# EAGLE schematic modifiedradio (EAGLE 7.5.0)
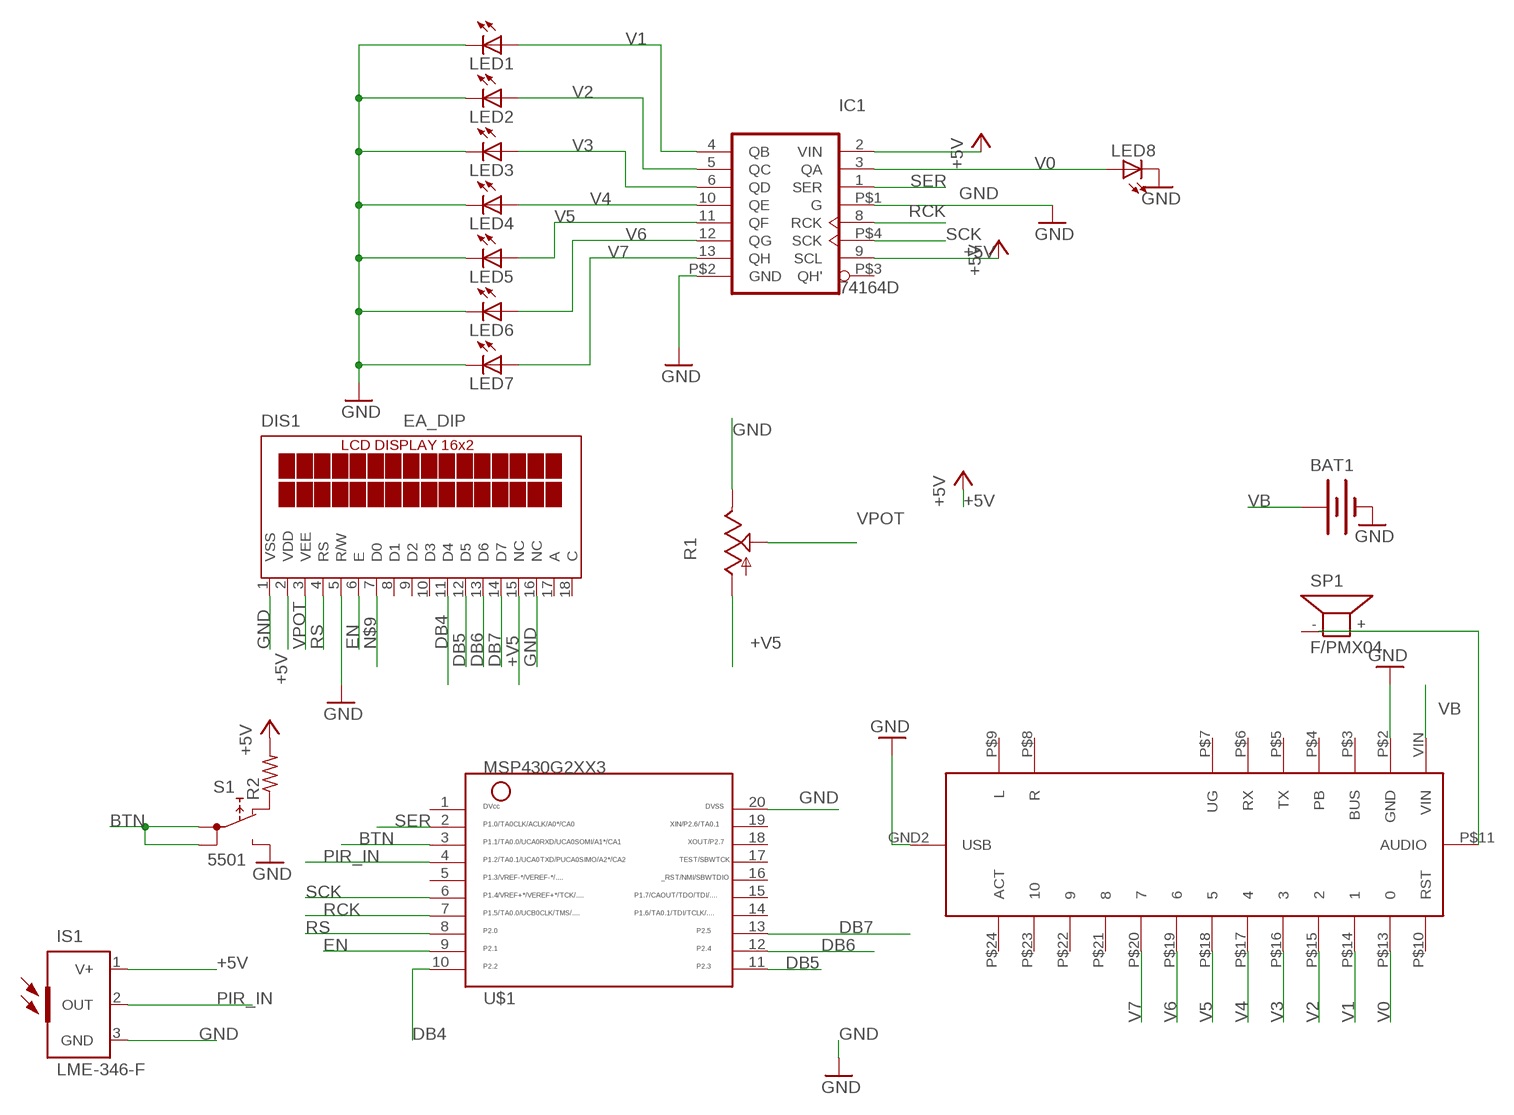
[diagram p0: schematic, sheet 1]

## Parts
BAT1  BATTERY  [BATTERY_PACK_2AA]
DIS1  EA_DIP  [EA_DIP]
IC1  74164D  [SO14]
IS1  LME-346-F  [TO39]
LED1  LED10MM  [LED10MM]
LED2  LED10MM  [LED10MM]
LED3  LED10MM  [LED10MM]
LED4  LED10MM  [LED10MM]
LED5  LED10MM  [LED10MM]
LED6  LED10MM  [LED10MM]
LED7  LED10MM  [LED10MM]
LED8  LED10MM  [LED10MM]
R1  TRIM_US-RS3  [RS3]
R2  R-US_0204/2V  [0204V]
S1  5501  [5501]
SP1  F/PMX04  [F/PMX04A]
U$1  MSP430G2XX3TSSOP  [PW20]
U$2  SOUNDBOARD  [SOUNDBOARD]

## Nets
+5V: DIS1.2(VDD) IC1.2(VIN) IC1.9(SCL) IS1.1(V+) R2.2
+V5: DIS1.15(NC) R1.A
BTN: S1.1A S1.1B U$1.3
DB4: DIS1.11(D4) U$1.10
DB5: DIS1.12(D5) U$1.11
DB6: DIS1.13(D6) U$1.12
DB7: DIS1.14(D7) U$1.13
EN: DIS1.6(E) U$1.9
GND: BAT1.GND(-) DIS1.1(VSS) DIS1.5(R/W) DIS1.16(NC) IC1.P$1(G) IC1.P$2(GND) IS1.3(GND) LED1.K(C) LED2.K(C) LED3.K(C) LED4.K(C) LED5.K(C) LED6.K(C) LED7.K(C) LED8.K(C) R1.E S1.NO U$1.20 U$2.GND2(USB) U$2.P$2(GND)
N$1: SP1.+ U$2.P$11(AUDIO)
N$9: DIS1.7(D0)
N$40: R2.1 S1.NC
PIR_IN: IS1.2(OUT) U$1.4
RCK: IC1.8(RCK) U$1.7
RS: DIS1.4(RS) U$1.8
SCK: IC1.P$4(SCK) U$1.6
SER: IC1.1(SER) U$1.2
V0: IC1.3(QA) LED8.A U$2.P$13
V1: IC1.4(QB) LED1.A U$2.P$14
V2: IC1.5(QC) LED2.A U$2.P$15
V3: IC1.6(QD) LED3.A U$2.P$16
V4: IC1.10(QE) LED4.A U$2.P$17
V5: IC1.11(QF) LED5.A U$2.P$18
V6: IC1.12(QG) LED6.A U$2.P$19
V7: IC1.13(QH) LED7.A U$2.P$20
VB: BAT1.3V(+) U$2.VIN
VPOT: DIS1.3(VEE) R1.S
Unconnected: DIS1.8(D1) DIS1.9(D2) DIS1.10(D3) DIS1.17(A) DIS1.18(C) IC1.P$3(QH') SP1.- U$1.1 U$1.5 U$1.14 U$1.15 U$1.16 U$1.17 U$1.18 U$1.19 U$2.P$3(BUS) U$2.P$4(PB) U$2.P$5(TX) U$2.P$6(RX) U$2.P$7(UG) U$2.P$8(R) U$2.P$9(L) U$2.P$10(RST) U$2.P$21 U$2.P$22 U$2.P$23 U$2.P$24(ACT)

## Power pins joined to a net without a drawn wire
GND: IC1.7(GND)
VCC: IC1.14(VCC)

## Library data of the parts
BAT1 = ELEC327:BATTERY: Battery Holders Various common sizes : AA, AAA, 20mm coin cell and 12mm coin cell. 20MM_4LEGS, BATT-10373
DIS1 = display-lcd:EA_DIP: LCD-MODUL 2x16 - 6,68mm, INKL. KONTROLLER HD44780 Source: Data sheet <http://www.lcd-module.de/pdf/doma/dip162-d.pdf>
IC1 = 74xx-us:74*164: 8-bit parallel out SHIFT REGISTER
IS1 = sensor-infratec:LME-346-F: pyroelectric detector Source: http://www.InfraTec.de .. Datasheet_S85159.pdf; OC_FARNELL: unknown; OC_NEWARK: unknown
LED1-LED8 = led:LED: LED OSRAM: - CHIPLED LG R971, LG N971, LY N971, LG Q971, LY Q971, LO R971, LY R971 LH N974, LH R974 LS Q976, LO Q976, LY Q976 LO Q996 - Hyper CHIPLED LW Q18S LB Q993, LB Q99A, LB R99A - SideLED LS A670, LO A670, LY A670, LG A670, LP A670 LB A673, LV A673, LT A673, LW A673 LH A674 LY A675 LS A676, LA A676, LO A676, LY A676, LW A676 LS A679, LY A679, LG A679 - Hyper Micro SIDELED® LS Y876, LA Y876, LO Y876, LY Y876 LT Y87S - SmartLED LW L88C, LW L88S LB L89C, LB L89S, LG L890 LS L89K, LO L89K, LY L89K LS L896, LA L896, LO L896, LY L896 - TOPLED LS T670, LO T670, LY T670, LG T670, LP T670 LSG T670, LSP T670, LSY T670, LOP T670, LYG T670 LG T671, LOG T671, LSG T671 LB T673, LV T673, LT T673, LW T673 LH T674 LS T676, LA T676, LO T676, LY T676, LB T676, LH T676, LSB T676, LW T676 LB T67C, LV T67C, LT T67C, LS T67K, LO T67K, LY T67K, LW E67C LS E67B, LA E67B, LO E67B, LY E67B, LB E67C, LV E67C, LT E67C LW T67C LS T679, LY T679, LG T679 LS T770, LO T770, LY T770, LG T770, LP T770 LB T773, LV T773, LT T773, LW T773 LH T774 LS E675, LA E675, LY E675, LS T675 LS T776, LA T776, LO T776, LY T776, LB T776 LHGB T686 LT T68C, LB T68C - Hyper Mini TOPLED® LB M676 - Mini TOPLED Santana® LG M470 LS M47K, LO M47K, LY M47K Source: http://www.osram.convergy.de LUXEON: - LUMILED® LXK2-PW12-R00, LXK2-PW12-S00, LXK2-PW14-U00, LXK2-PW14-V00 LXK2-PM12-R00, LXK2-PM12-S00, LXK2-PM14-U00 LXK2-PE12-Q00, LXK2-PE12-R00, LXK2-PE12-S00, LXK2-PE14-T00, LXK2-PE14-U00 LXK2-PB12-K00, LXK2-PB12-L00, LXK2-PB12-M00, LXK2-PB14-N00, LXK2-PB14-P00, LXK2-PB14-Q00 LXK2-PR12-L00, LXK2-PR12-M00, LXK2-PR14-Q00, LXK2-PR14-R00 LXK2-PD12-Q00, LXK2-PD12-R00, LXK2-PD12-S00 LXK2-PH12-R00, LXK2-PH12-S00 LXK2-PL12-P00, LXK2-PL12-Q00, LXK2-PL12-R00 Source: www.luxeon.com KINGBRIGHT: KA-3528ASYC Source: www.kingbright.com
R1 = pot:TRIM_US-: POTENTIOMETER
R2 = LazyMan:R-US_: RESISTOR, American symbol
S1 = switch:55?: PUSHBUTTON SERIES 5500 SWITCHES Source: www.e-switch.com .. 5500.pdf
SP1 = buzzer:F/PMX04: SPEAKER Source: Buerklin; OC_FARNELL: unknown; OC_NEWARK: unknown
U$1 = ELEC327:MSP430G2XX3: MSP430G2XX3 PDIP (N) 20 Pin Package
U$2 = my_Library:SOUNDBOARD

## Module POTENITOMETER
Ports: 

### Library data of the parts